# EAGLE design working (EAGLE 9.6.2)
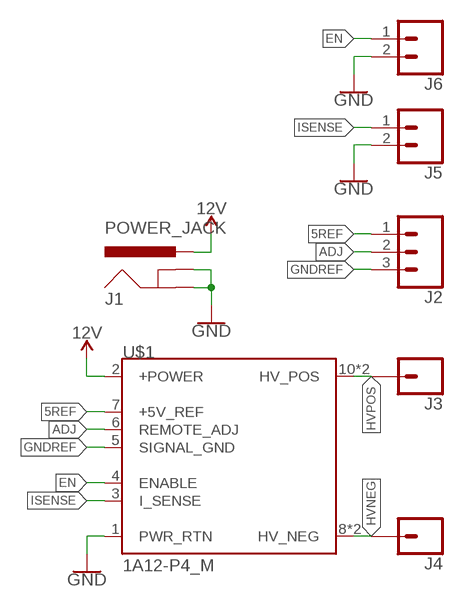
[diagram p0: schematic, sheet 1]

## Parts
J1  POWER_JACK  [POWER_JACK_PTH]
J2  CONN_031X03_NO_SILK  [1X03_NO_SILK]
J3  CONN_01PTH_2MM  [1X01_2MM]
J4  CONN_01PTH_2MM  [1X01_2MM]
J5  CONN_021X02_NO_SILK  [1X02_NO_SILK]
J6  CONN_021X02_NO_SILK  [1X02_NO_SILK]
U$1  1A12-P4_M  [ULTRAVOLT]

## Nets
5REF: J2.1 U$1.7(+5V_REF)
12V: J1.PWR U$1.2(+POWER)
ADJ: J2.2 U$1.6(REMOTE_ADJ)
EN: J6.1 U$1.4(ENABLE)
GND: J1.GND J1.GNDBREAK J5.2 J6.2 U$1.1(PWR_RTN)
GNDREF: J2.3 U$1.5(SIGNAL_GND)
HVNEG: J4.1 U$1.8(HV_NEG) U$1.9(HV_NEG)
HVPOS: J3.1 U$1.10(HV_POS) U$1.11(HV_POS)
ISENSE: J5.1 U$1.3(I_SENSE)

## Library data of the parts
J1 = SparkFun-Connectors:POWER_JACK: Power Jack Connector This is the standard 5.5mm barrel jack for power. The PTH is the most common, proven, reliable, footprint. The Slot footprint only works if the mill layer is transmitted to the PCB fab house so be warned. Here are the connectors we sell at SparkFun: DC Barrel Power Jack/Connector <https://www.sparkfun.com/products/119> (PRT-00119) DC Barrel Power Jack/Connector (SMD) <https://www.sparkfun.com/products/12748> (PRT-12748) DC Barrel Jack Adapter - Breadboard Compatible <https://www.sparkfun.com/products/10811> (PRT-10811) It is used on this SparkFun product (and many, many others): SparkFun RedBoard - Programmed with Arduino <https://www.sparkfun.com/products/12757> (DEV-12757) Also, if you need a mating power supply or connector, please check these out: Wall Adapter Power Supply - 9VDC 650mA <https://www.sparkfun.com/products/298> (TOL-00298) DC Barrel Jack Adapter - Male <https://www.sparkfun.com/products/10287> (PRT-10287); PROD_ID: CONN-08197
J2 = SparkFun-Connectors:CONN_03: Multi connection point. Often used as Generic Header-pin footprint for 0.1 inch spaced/style header connections On any of the 0.1 inch spaced packages, you can populate with these: Break Away Headers - Straight <https://www.sparkfun.com/products/116> (PRT-00116) Break Away Male Headers - Right Angle <https://www.sparkfun.com/products/553> (PRT-00553) Female Headers <https://www.sparkfun.com/products/115> (PRT-00115) Break Away Headers - Machine Pin <https://www.sparkfun.com/products/117> (PRT-00117) Break Away Female Headers - Swiss Machine Pin <https://www.sparkfun.com/products/743> (PRT-00743) Stackable Header - 3 Pin (Female, 0.1") <https://www.sparkfun.com/products/13875> (PRT-13875) For SCREWTERMINALS and SPRING TERMINALS visit here: Screw Terimnals on SparkFun.com <https://www.sparkfun.com/search/results?term=Screw+Terminals> (5mm/3.5mm/2.54mm spacing) This device is also useful as a general connection point to wire up your design to another part of your project. Our various solder wires solder well into these plated through hole pads. Hook-Up Wire - Assortment (Stranded, 22 AWG) <https://www.sparkfun.com/products/11375> (PRT-11375) Hook-Up Wire - Assortment (Solid Core, 22 AWG) <https://www.sparkfun.com/products/11367> (PRT-11367) View the entire wire category on our website here <https://www.sparkfun.com/categories/141> Special notes: Molex polarized connector foot print use with SKU : PRT-08232 with associated crimp pins and housings.
J3 J4 = SparkFun-Connectors:CONN_01: Single connection point. Often used as Generic Header-pin footprint for 0.1 inch spaced/style header connections On any of the 0.1 inch spaced packages, you can populate with these: Break Away Headers - Straight <https://www.sparkfun.com/products/116> (PRT-00116) Break Away Male Headers - Right Angle <https://www.sparkfun.com/products/553> (PRT-00553) Female Headers <https://www.sparkfun.com/products/115> (PRT-00115) Break Away Headers - Machine Pin <https://www.sparkfun.com/products/117> (PRT-00117) Break Away Female Headers - Swiss Machine Pin <https://www.sparkfun.com/products/743> (PRT-00743) This device is also useful as a general connection point to wire up your design to another part of your project. Our various solder wires solder well into these plated through hole pads. Hook-Up Wire - Assortment (Stranded, 22 AWG) <https://www.sparkfun.com/products/11375> (PRT-11375) Hook-Up Wire - Assortment (Solid Core, 22 AWG) <https://www.sparkfun.com/products/11367> (PRT-11367) View the entire wire category on our website here <https://www.sparkfun.com/categories/141> Special notes: SMTSO-256-ET is a "flush mount" nut for a 4-40 screw. We mostly use this on specialty testbeds; it is a nice way to connect hardware to your PCB at an adjustable hieght. Also note, the SNAP packages are for using a snappable style connector. We sell a baggie of snaps and they are also used on two LilyPad designs: Snap Assortment - 30 pack (male and female) <https://www.sparkfun.com/products/11347> (DEV-11347) LilyPad Arduino SimpleSnap <https://www.sparkfun.com/products/10941> (DEV-10941) LilyPad SimpleSnap Protoboard <https://www.sparkfun.com/products/10940> (DEV-10940)
J5 J6 = SparkFun-Connectors:CONN_02: Multi connection point. Often used as Generic Header-pin footprint for 0.1 inch spaced/style header connections On any of the 0.1 inch spaced packages, you can populate with these: Break Away Headers - Straight <https://www.sparkfun.com/products/116> (PRT-00116) Break Away Male Headers - Right Angle <https://www.sparkfun.com/products/553> (PRT-00553) Female Headers <https://www.sparkfun.com/products/115> (PRT-00115) Break Away Headers - Machine Pin <https://www.sparkfun.com/products/117> (PRT-00117) Break Away Female Headers - Swiss Machine Pin <https://www.sparkfun.com/products/743> (PRT-00743) For SCREWTERMINALS and SPRING TERMINALS visit here: Screw Terimnals on SparkFun.com <https://www.sparkfun.com/search/results?term=Screw+Terminals> (5mm/3.5mm/2.54mm spacing) This device is also useful as a general connection point to wire up your design to another part of your project. Our various solder wires solder well into these plated through hole pads. Hook-Up Wire - Assortment (Stranded, 22 AWG) <https://www.sparkfun.com/products/11375> (PRT-11375) Hook-Up Wire - Assortment (Solid Core, 22 AWG) <https://www.sparkfun.com/products/11367> (PRT-11367) View the entire wire category on our website here <https://www.sparkfun.com/categories/141> Special notes: Molex polarized connector foot print use with: PRT-08233 with associated crimp pins and housings. 2.54_SCREWTERM for use with PRT-10571. 3.5mm Screw Terminal footprints for PRT-08084 5mm Screw Terminal footprints for use with PRT-08432
U$1 = GreatBigFactory:1A12-P4_M

## Board
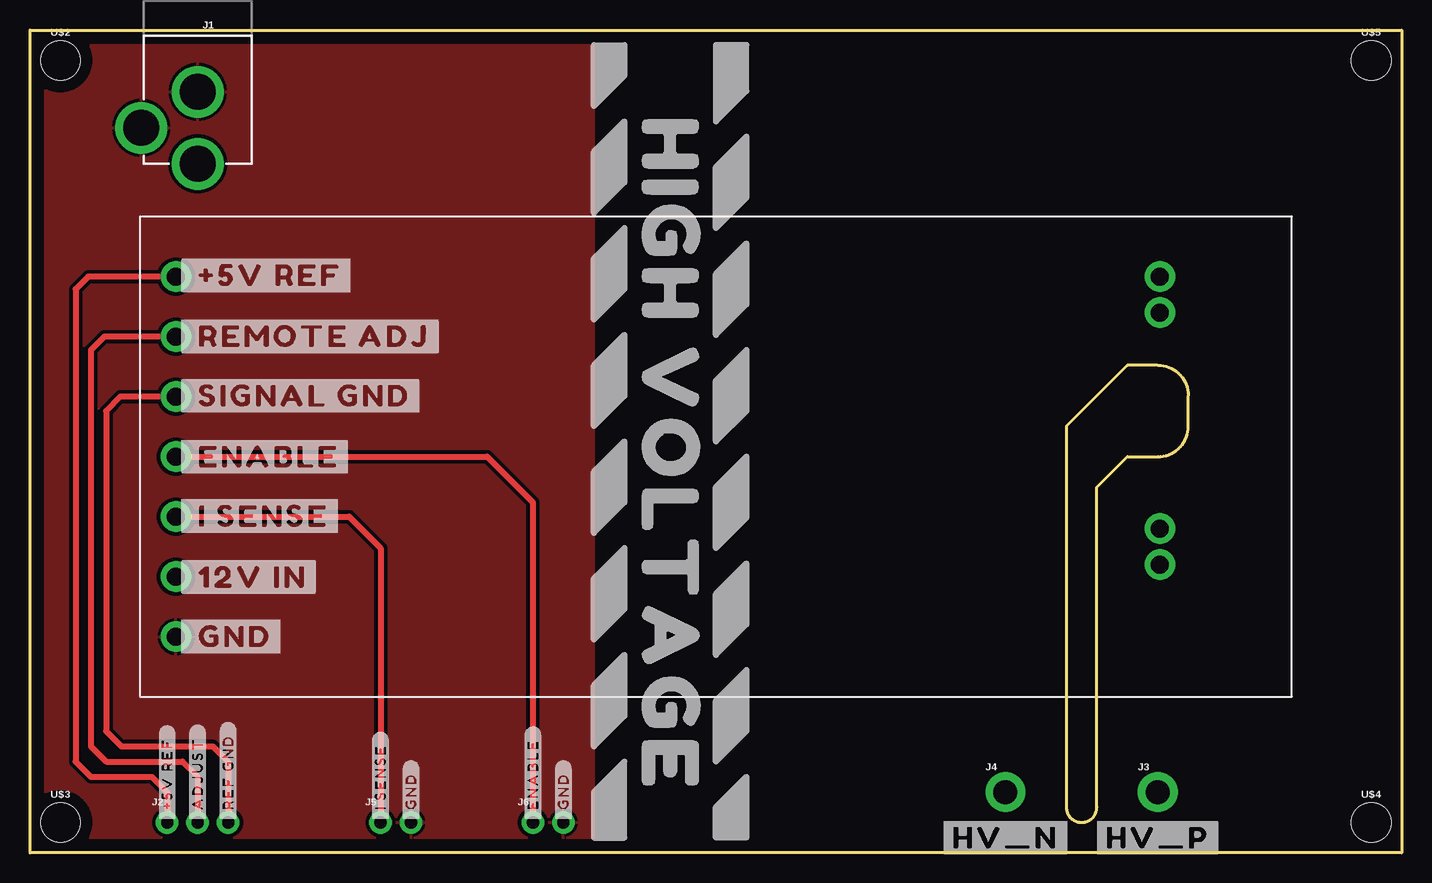
[diagram p1: board, top side]
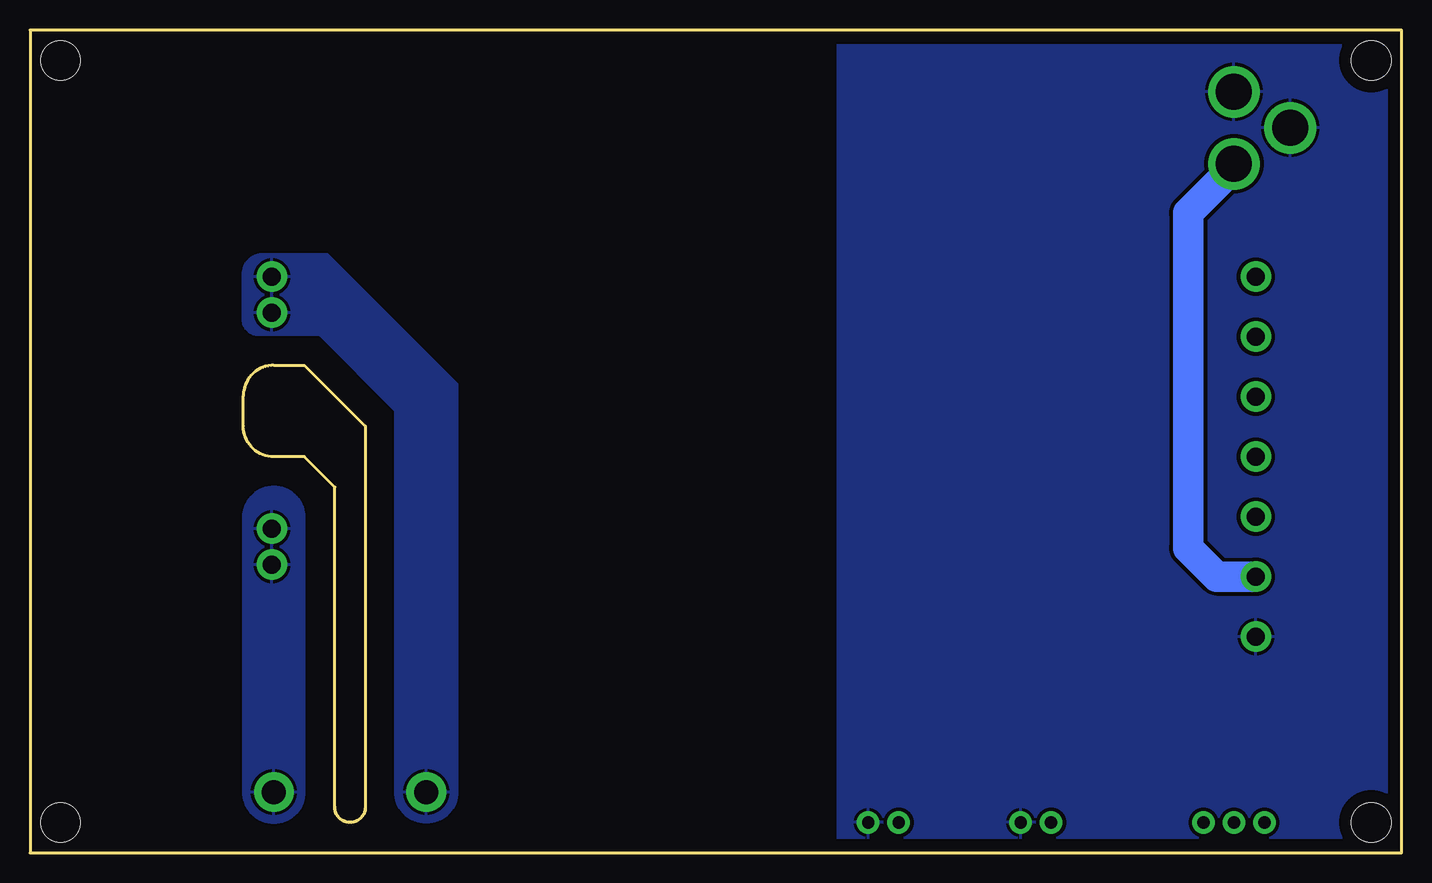
[diagram p2: board, bottom side, seen from below]

Size 114.3 x 68.58 mm. Coordinates in mm from the lower left corner, seen from the top.
Outline: 0,0 0,68.58 114.3,68.58 114.3,0 0,0
Outline: 88.9,3.81 88.9,30.48 91.44,33.02 93.98,33.02 arc90 96.52,35.56 96.52,38.1 arc90 93.98,40.64 91.44,40.64 86.36,35.56 86.36,3.81 arc90 87.63,2.54 arc90 88.9,3.81
Copper layers (1*16): Top 0.035mm / dielectric 1.5mm / Bottom 0.035mm
Design rules "default": minimum track width 6mil, minimum drill 0.35mm, track to track 6mil, track to pad 6mil, pad to pad 6mil, via to via 6mil, smd to smd 6mil, copper to edge 40mil, drill to drill 6mil, minimum pad ring 10mil, minimum via ring 8mil, stop-mask expansion 4mil, vias tented up to drill 0mil, thermal gap 10mil

### Footprints (pad centres in the part's own frame; a part is rotated, then mirrored left to right if it is on the bottom)
POWER_JACK_PTH = drill 2.997 pad 4.318: GND 0,7.7; GNDBREAK 4.7,10.7; PWR 0,13.7
1X03_NO_SILK = drill 1.016 pad 1.88: 1 0,0; 2 2.54,0; 3 5.08,0
1X01_2MM = drill 2 pad 3.302: 1 0,0
1X02_NO_SILK = drill 1.016 pad 1.88: 1 0,0; 2 2.54,0
ULTRAVOLT = drill 1.5 pad 2.54: 1 -15,45; 2 -10,45; 3 -5,45; 4 0,45; 5 5,45; 6 10,45; 7 15,45; 8 15,-37; 9 12,-37; 10 -6,-37; 11 -9,-37
STAND-OFF = hole 3.302: 0,0

### Placement (x,y rotation side)
J1  13.97,71.12 180 top
J2  11.43,2.54 0 top
J3  93.98,5.08 0 top
J4  81.28,5.08 0 top
J5  29.21,2.54 0 top
J6  41.91,2.54 0 top
U$1  57.15,33.02 90 top
U$2  [STAND-OFF]  2.54,66.04 0 top
U$3  [STAND-OFF]  2.54,2.54 0 top
U$4  [STAND-OFF]  111.76,2.54 0 top
U$5  [STAND-OFF]  111.76,66.04 0 top
U$6  [HIGH_VOLTAGE0]  53.34,64.77 270 top
U$7  [#_#5V_REF#0]  11.94,48.13 0 top
U$8  [#_REMOTE_ADJ#0]  11.94,43.05 0 top
U$9  [#_SIGNAL_GND#0]  11.94,38.1 0 top
U$10  [#_ENABLE#0]  11.94,33.02 0 top
U$11  [#_I_SENSE#0]  11.94,28.07 0 top
U$12  [#_12V_IN#0]  11.94,22.99 0 top
U$13  [#_GND#0]  11.94,18.03 0 top
U$14  [#_#5V_REF_#0]  11.43,2.54 90 top
U$15  [#_ADJUST_#0]  13.97,2.54 90 top
U$16  [#HV_N#0]  81.28,1.27 0 top
U$17  [#HV_P#0]  93.98,1.27 0 top
U$18  [#_REF_GND_#0]  16.51,2.54 90 top
U$19  [#_I_SENSE_#0]  29.21,2.54 90 top
U$20  [#_ENABLE_#0]  41.91,2.54 90 top
U$21  [#_GND_#0]  31.75,2.54 90 top
U$22  [#_GND_#0]  44.45,2.54 90 top

### Tracks (layer width: path | path; a pad name or v marks a point on that pad's centre or on a via)
5REF
  Top 0.508: U$1.7 4.84,48.02 3.81,46.99 3.81,7.62 5.08,6.35 10.16,6.35 11.43,5.08 J2.1
12V
  Bottom 2.54: J1.PWR 13.97,57.15 17.78,53.34 17.78,25.4 15.4,23.02 U$1.2
ADJ
  Top 0.508: U$1.6 6.19,43.02 5.08,41.91 5.08,8.89 6.35,7.62 12.7,7.62 13.97,6.35 J2.2
EN
  Top 0.508: U$1.4 38.1,33.02 41.91,29.21 J6.1
GND
  pour Top (isolate 0.305): 0,68.58 0,0 46.99,0 46.99,68.58
  pour Bottom (isolate 0.305): 0,68.58 46.99,68.58 46.99,0 0,0
GNDREF
  Top 0.508: U$1.5 7.54,38.02 6.35,36.83 6.35,10.16 7.62,8.89 15.24,8.89 16.51,7.62 J2.3
HVNEG
  pour Bottom (isolate 0.305): 83.82,5.08 83.82,36.83 90.17,43.18 95.25,43.18 arc90 96.52,44.45 96.52,48.26 arc90 94.87,49.91 89.53,49.91 78.74,39.12 78.74,5.08 arc90 81.28,2.54 arc90
HVPOS
  pour Bottom (isolate 0.305): 91.44,5.08 91.44,27.94 arc-90 93.98,30.48 arc-90 96.52,27.94 96.52,5.08 arc-90 93.98,2.54 arc-90
ISENSE
  Top 0.508: U$1.3 26.59,28.02 29.21,25.4 J5.1